# EAGLE design V3.81 - placa embutida rele smd (EAGLE 9.6.2)
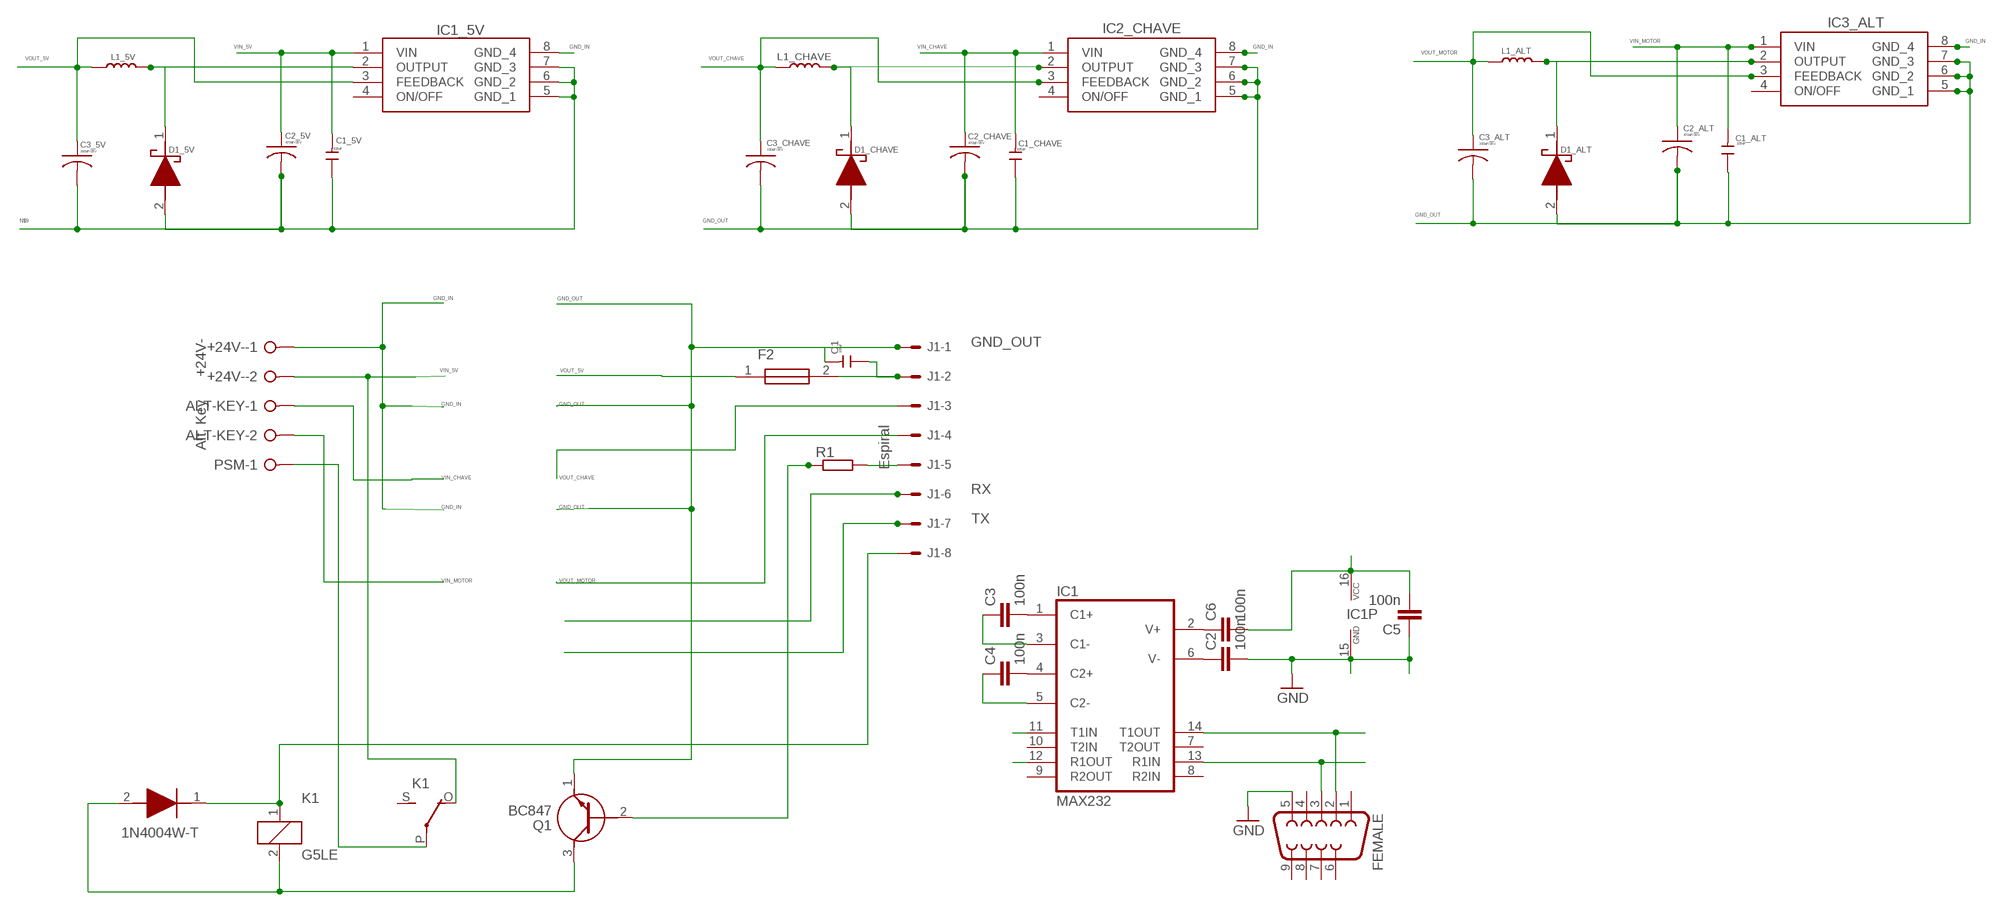
[diagram p0: schematic, sheet 1]

## Parts
+24V-  +24V-  W237-02P  [W237-132]
ALT-KEY  Alt Key  W237-02P  [W237-132]
C1  105uF  C-0805  [C0805]
C1_5V  105uF  C-0805  [C0805]
C1_ALT  105uF  C-0805  [C0805]
C1_CHAVE  105uF  C-0805  [C0805]
C2  100n  C-EUC0805  [C0805]
C2_5V  470uF/35V  C-USC0201  [C0201]
C2_ALT  470uF/35V  C-USC0201  [C0201]
C2_CHAVE  470uF/35V  C-USC0201  [C0201]
C3  100n  C-EUC0805  [C0805]
C3_5V  180uF/35V  C-USC0201  [C0201]
C3_ALT  330uF/35V  C-USC0201  [C0201]
C3_CHAVE  330uF/35V  C-USC0201  [C0201]
C4  100n  C-EUC0805  [C0805]
C5  100n  C-EUC0805  [C0805]
C6  100n  C-EUC0805  [C0805]
D1_5V  1N5819HW1-7-F  [SODFL3518X115N]
D1_ALT  1N5819HW1-7-F  [SODFL3518X115N]
D1_CHAVE  1N5819HW1-7-F  [SODFL3518X115N]
D2  1N4004W-T  [SODFL3818X130N]
F2  0679H1000-05  [FUSC6125X279N]
FEMALE  F09H  [F09H]
IC1  MAX232  MAX232ECWES  [SO16]
IC1_5V  XL1509-5.0E1  [SOIC127P600X175-8N]
IC2_CHAVE  XL1509-3.3E1  [SOIC127P600X175-8N]
IC3_ALT  XL1509-3.3E1  [SOIC127P600X175-8N]
J1  Espiral  22-05-7088-08  [7395-08]
K1  G5LE  [G5LE]
L1_5V  68uH  L'PIO73'  [PIO73]
L1_ALT  47uH  L'PIO73'  [PIO73]
L1_CHAVE  47uH  L'PIO73'  [PIO73]
PSM  PSM  W237-02P  [W237-132]
Q1  BC847  [BC847]
R1  SMR-WAV  [SMS-WAV]

## Nets
5V: C5.2 C6.2 IC1.16(VCC)
GND: C2.2 C5.1 FEMALE.5 IC1.15(GND)
GND_IN: +24V-.1 IC1_5V.8(GND_4) IC2_CHAVE.8(GND_4) IC3_ALT.8(GND_4)
GND_OUT: C1.2 C1_ALT.1 C1_CHAVE.1 C2_ALT.2 C2_CHAVE.2 C3_ALT.2 C3_CHAVE.2 D1_ALT.2(A) D1_CHAVE.2(A) IC2_CHAVE.5(GND_1) IC2_CHAVE.6(GND_2) IC2_CHAVE.7(GND_3) IC3_ALT.5(GND_1) IC3_ALT.6(GND_2) IC3_ALT.7(GND_3) J1.1 Q1.1(E)
N$1: D1_CHAVE.1(K) IC2_CHAVE.2(OUTPUT) L1_CHAVE.1
N$2: D1_5V.1(K) IC1_5V.2(OUTPUT) L1_5V.1
N$3: D1_ALT.1(K) IC3_ALT.2(OUTPUT) L1_ALT.1
N$5: Q1.2(B) R1.2
N$6: J1.5 R1.1
N$9: C1_5V.1 C2_5V.2 C3_5V.2 D1_5V.2(A) IC1_5V.5(GND_1) IC1_5V.6(GND_2) IC1_5V.7(GND_3)
N$10: C3.2 IC1.1(C1+)
N$11: C1.1 F2.2 J1.2
N$12: C4.2 IC1.4(C2+)
N$13: C3.1 IC1.3(C1-)
N$14: C4.1 IC1.5(C2-)
N$15: C6.1 IC1.2(V+)
N$16: C2.1 IC1.6(V-)
N$19: FEMALE.2 IC1.14(T1OUT)
N$20: FEMALE.3 IC1.13(R1IN)
N$38: D2.2(A) K1.2 Q1.3(C)
N$39: D2.1(K) J1.8 K1.1
N$40: K1.P(2:P) PSM.1
RX: IC1.12(R1OUT) J1.6
TX: IC1.11(T1IN) J1.7
VIN_5V: +24V-.2 C1_5V.2 C2_5V.1 IC1_5V.1(VIN) K1.O(2:O)
VIN_CHAVE: ALT-KEY.1 C1_CHAVE.2 C2_CHAVE.1 IC2_CHAVE.1(VIN)
VIN_MOTOR: ALT-KEY.2 C1_ALT.2 C2_ALT.1 IC3_ALT.1(VIN)
VOUT_5V: C3_5V.1 F2.1 IC1_5V.3(FEEDBACK) L1_5V.2
VOUT_CHAVE: C3_CHAVE.1 IC2_CHAVE.3(FEEDBACK) J1.3 L1_CHAVE.2
VOUT_MOTOR: C3_ALT.1 IC3_ALT.3(FEEDBACK) J1.4 L1_ALT.2
Unconnected: FEMALE.1 FEMALE.4 FEMALE.6 FEMALE.7 FEMALE.8 FEMALE.9 IC1.7(T2OUT) IC1.8(R2IN) IC1.9(R2OUT) IC1.10(T2IN) IC1_5V.4(ON/OFF) IC2_CHAVE.4(ON/OFF) IC3_ALT.4(ON/OFF) K1.S(2:S) PSM.2

## Library data of the parts
+24V- ALT-KEY PSM = con-wago-508:W237-02P: WAGO SREW CLAMP; OC_FARNELL: unknown; OC_NEWARK: unknown
C1 C1_5V C1_ALT C1_CHAVE = Discrete:C*: Ceramic Capacitors
C2-C6 = rcl:C-EU: CAPACITOR, European symbol
C2_5V C2_ALT C2_CHAVE C3_5V C3_ALT C3_CHAVE = rcl:C-US: CAPACITOR, American symbol; SPICEPREFIX: C
D1_5V D1_ALT D1_CHAVE = 1N5819HW1-7-F:1N5819HW1-7-F: 1N5819 Schottky Diode 40V 1A SOD123F Source: Datasheet <https://www.diodes.com/assets/Datasheets/1N5819HW1.pdf>; ARROW_PART_NUMBER: 1N5819HW1-7-F; ARROW_PRICE-STOCK: https://www.arrow.com/en/products/1n5819hw1-7-f/diodes-incorporated?region=nac; DESCRIPTION: 1N5819 Schottky Diode 40V 1A SOD123F; HEIGHT: 1.15mm; MANUFACTURER_NAME: Diodes Inc.; MANUFACTURER_PART_NUMBER: 1N5819HW1-7-F; MOUSER_PART_NUMBER: 621-1N5819HW1-7-F; MOUSER_PRICE-STOCK: https://www.mouser.co.uk/ProductDetail/Diodes-Incorporated/1N5819HW1-7-F?qs=60RJRzIpcl9ACQG7Zn63jQ%3D%3D
D2 = 1N4004W-T:1N4004W-T: Rectifiers SOD-123,1A,400V,GP Source: Datasheet <https://www.mouser.mx/datasheet/2/345/1n4001w_1n4007w-2449105.pdf>; DESCRIPTION: Rectifiers SOD-123,1A,400V,GP; HEIGHT: 1.3mm; MANUFACTURER_NAME: Rectron; MANUFACTURER_PART_NUMBER: 1N4004W-T; MOUSER_PART_NUMBER: 583-1N4004W-T; MOUSER_PRICE-STOCK: https://www.mouser.co.uk/ProductDetail/Rectron/1N4004W-T?qs=QNEnbhJQKvYW6o2Wv4Vvaw%3D%3D
F2 = 0679H1000-05:0679H1000-05: Fuse Chip Fast Acting 1A 350V Solder Pad SMD 2410 Ceramic T/R Source: Datasheet <https://www.arrow.com/en/products/0679h1000-05/bel-group>; ARROW_PART_NUMBER: 0679H1000-05; ARROW_PRICE-STOCK: https://www.arrow.com/en/products/0679h1000-05/bel-group?region=nac; DESCRIPTION: Fuse Chip Fast Acting 1A 350V Solder Pad SMD 2410 Ceramic T/R; HEIGHT: 2.79mm; MANUFACTURER_NAME: Bel Circuit Protection; MANUFACTURER_PART_NUMBER: 0679H1000-05
FEMALE = con-subd:F09: SUB-D
IC1 = maxim-6b:MAX232ECWE: RS232 TRANSEIVER
IC1_5V = XL1509-5.0E1:XL1509-5.0E1: 2A 150KHz 40V Buck DC to DC Converter. Source: Datasheet <https://datasheet.lcsc.com/szlcsc/XLSEMI-XL1509-5-0E1_C61063.pdf>; DESCRIPTION: 2A 150KHz 40V Buck DC to DC Converter.; HEIGHT: 1.75mm; MANUFACTURER_NAME: XLSEMI; MANUFACTURER_PART_NUMBER: XL1509-5.0E1
IC2_CHAVE IC3_ALT = XL1509-3.3E1:XL1509-3.3E1: 40V 2A SOP-8_150mil DC-DC Converters RoHS Source: Datasheet <https://datasheet.lcsc.com/szlcsc/XLSEMI-XL1509-3-3E1_C74193.pdf>; DESCRIPTION: 40V 2A SOP-8_150mil DC-DC Converters RoHS; HEIGHT: 1.75mm; MANUFACTURER_NAME: XLSEMI; MANUFACTURER_PART_NUMBER: XL1509-3.3E1
J1 = con-molex:22-?-08: CONNECTOR wire to board 2.54 mm (.1 inch) pitch header; MF: MOLEX; OC_FARNELL: unknown; OC_NEWARK: unknown
K1 = relay:G5LE: RELAY 1 x switch, 10 A/120 V AC, 8 A/30 V DC, Omron; OC_FARNELL: unknown; OC_NEWARK: unknown
L1_5V L1_ALT L1_CHAVE = Discrete:L*
Q1 = BC847:BC847: Epitaxial Planar NPN transistor Source: Datasheet <https://datasheet.datasheetarchive.com/originals/distributors/Datasheets-16/DSA-311605.pdf>; DESCRIPTION: Epitaxial Planar NPN transistor; HEIGHT: 1.3mm; MANUFACTURER_NAME: KEC; MANUFACTURER_PART_NUMBER: BC847
R1 = resistor-shunt:SMR-WAV: SMD SHUNT RESISTOR; OC_FARNELL: unknown; OC_NEWARK: unknown

## Module LDR
Ports: 

### Library data of the parts

## Net classes
1 New Class: width 0.5 mm, drill 1 mm

## Board
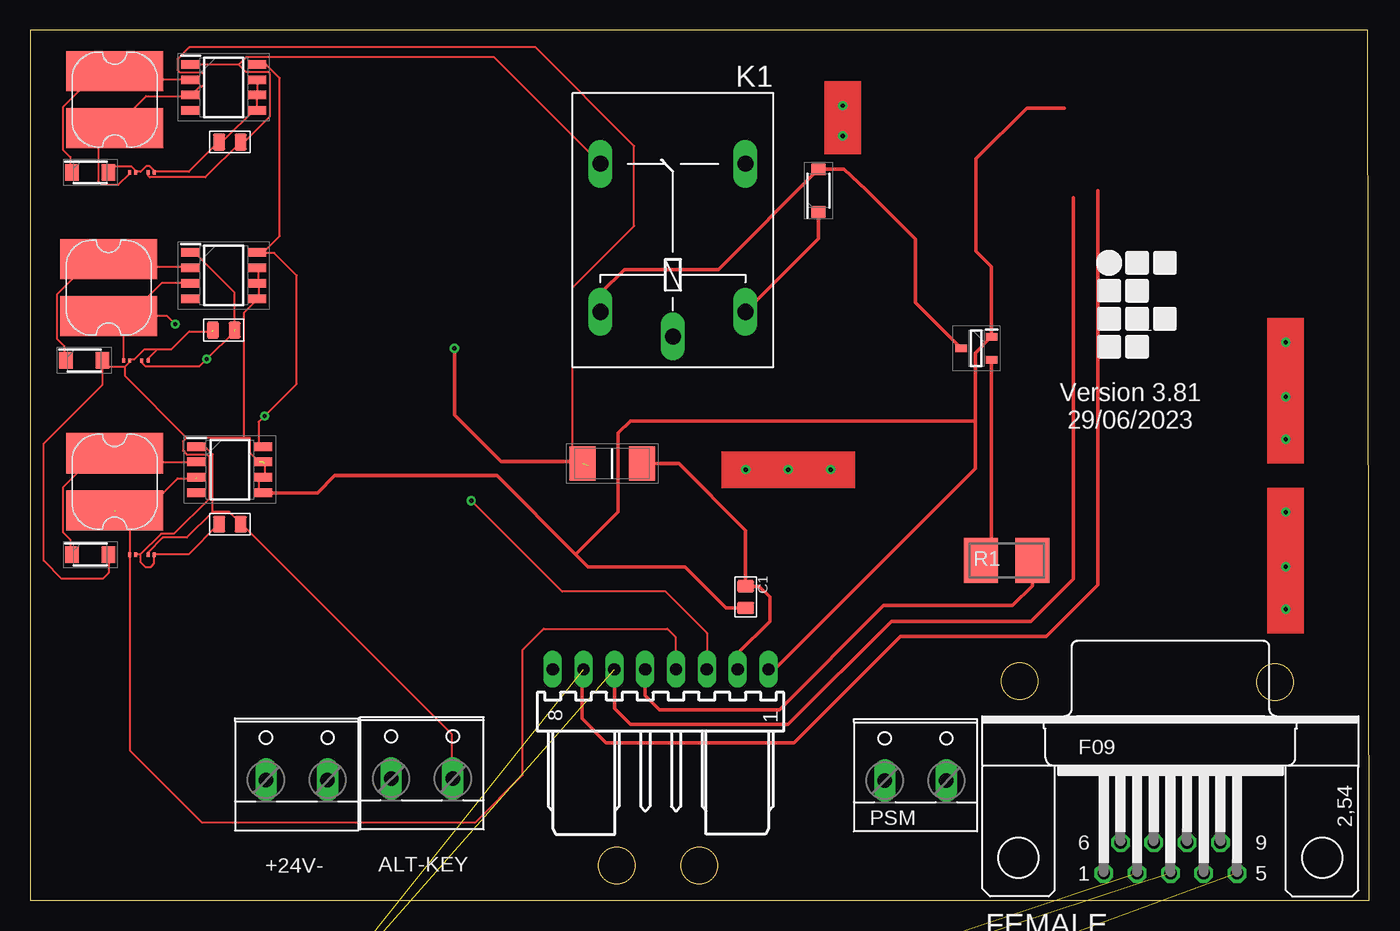
[diagram p1: board, top side]
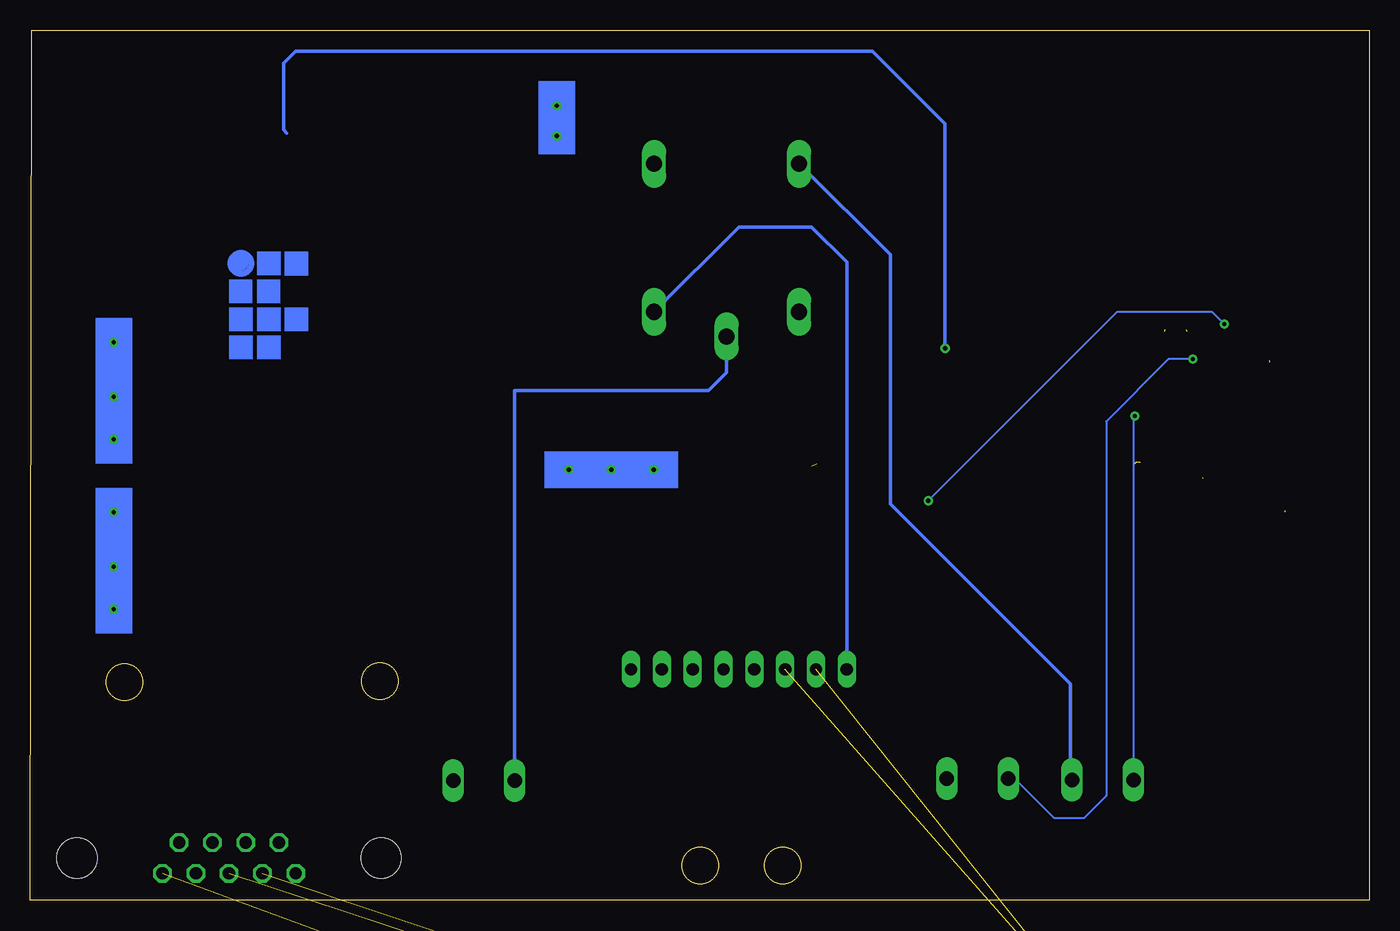
[diagram p2: board, bottom side, seen from below]

Size 110.32 x 71.7 mm. Coordinates in mm from the lower left corner, seen from the top.
Outline: 0,0 110.32,0 110.2,71.7 0,71.7 0,0
Outline: circle at 102.55,17.99 radius 1.5
Outline: circle at 81.51,18.05 radius 1.5
Outline: circle at 48.31,2.85 radius 1.5
Outline: circle at 55.11,2.85 radius 1.5
Copper layers (1*16): Top 0.035mm / dielectric 1.5mm / Bottom 0.035mm
Design rules "default *": minimum track width 6mil, minimum drill 0.35mm, track to track 6mil, track to pad 6mil, pad to pad 6mil, via to via 6mil, smd to smd 6mil, copper to edge 40mil, drill to drill 6mil, minimum pad ring 10mil, minimum via ring 8mil, stop-mask expansion 4mil, vias tented up to drill 0mil, thermal gap 10mil

### Footprints (pad centres in the part's own frame; a part is rotated, then mirrored left to right if it is on the bottom)
W237-132 = drill 1.194 long: 1 -2.54,-0.635; 2 2.54,-0.635
C0805 = smd 1.016 x 1.397: 1 -0.889,0; 2 0.889,0
C0805' = smd 1.3 x 1.5: 1 -0.95,0; 2 0.95,0
C0201 = smd 0.25 x 0.35: 1 -0.25,0; 2 0.25,0
SODFL3518X115N = smd 1.12 x 1.37: 1 -1.5,0; 2 1.5,0
SODFL3818X130N = smd 0.92 x 1.13: 1 -1.75,0; 2 1.75,0
FUSC6125X279N = smd 2.15 x 2.8: 1 -2.455,0; 2 2.455,0
F09H = drill 1.016 octagon: 1 -5.486,-1.27; 2 -2.743,-1.27; 3 0,-1.27; 4 2.743,-1.27; 5 5.486,-1.27; 6 -4.115,1.27; 7 -1.372,1.27; 8 1.372,1.27; 9 4.115,1.27 | hole 3.302: -12.522,0; 12.522,0
SO16 = smd 0.66 x 2.032: 1 -4.445,-3.073; 2 -3.175,-3.073; 3 -1.905,-3.073; 4 -0.635,-3.073; 5 0.635,-3.073; 6 1.905,-3.073; 7 3.175,-3.073; 8 4.445,-3.073; 9 4.445,3.073; 10 3.175,3.073; 11 1.905,3.073; 12 0.635,3.073; 13 -0.635,3.073; 14 -1.905,3.073; 15 -3.175,3.073; 16 -4.445,3.073
SOIC127P600X175-8N = smd 1.55 x 0.7: 1 -2.725,1.905; 2 -2.725,0.635; 3 -2.725,-0.635; 4 -2.725,-1.905; 5 2.725,-1.905; 6 2.725,-0.635; 7 2.725,0.635; 8 2.725,1.905
7395-08 = drill 1.016 long: 1 8.89,0; 2 6.35,0; 3 3.81,0; 4 1.27,0; 5 -1.27,0; 6 -3.81,0; 7 -6.35,0; 8 -8.89,0
G5LE = drill 1.321 long: 1 -7.493,-5.969; 2 -7.493,5.969; O 4.699,5.969; P -9.525,0; S 4.699,-5.969
PIO73 = smd 8 x 3.3: 1 0,2.35; 2 0,-2.35
BC847 = smd 0.95 x 0.65: 1 -1.25,-0.95; 2 -1.25,0.95; 3 1.25,0
SMS-WAV = smd 2.8 x 3.7: 1 2.108,0; 2 -2.108,0

### Placement (x,y rotation side)
+24V-  21.95,10.56 0 top
ALT-KEY  32.27,10.66 0 top
C1  58.94,24.99 270 top
C1_5V  16.44,62.49 0 top
C1_ALT  16.44,30.99 0 top
C1_CHAVE  15.94,46.99 0 top
C2  100n  [C0805']  14.94,-28.51 0 top  (outside the outline)
C2_5V  9.94,59.99 0 top
C2_ALT  9.94,28.49 0 top
C2_CHAVE  9.44,44.49 0 top
C3  100n  [C0805']  20.44,-28.51 0 top  (outside the outline)
C3_5V  8.44,59.99 0 top
C3_ALT  8.44,28.49 0 top
C3_CHAVE  7.94,44.49 0 top
C4  100n  [C0805']  25.94,-28.51 0 top  (outside the outline)
C5  100n  [C0805']  2.44,-37.01 0 top  (outside the outline)
C6  100n  [C0805']  7.94,-37.01 0 top  (outside the outline)
D1_5V  4.94,59.99 0 top
D1_ALT  4.94,28.49 0 top
D1_CHAVE  4.44,44.49 0 top
D2  64.94,58.49 90 top
F2  47.94,35.99 0 top
FEMALE  93.94,3.49 0 top
IC1  7.44,-29.51 0 top  (outside the outline)
IC1_5V  15.94,66.99 0 top
IC2_CHAVE  15.94,51.49 0 top
IC3_ALT  16.44,35.49 0 top
J1  51.93,19.03 0 top
K1  52.94,55.99 90 top
L1_5V  6.94,65.99 0 top
L1_ALT  6.94,34.49 0 top
L1_CHAVE  6.44,50.49 0 top
PSM  72.94,10.49 0 top
Q1  77.94,45.49 180 top
R1  80.44,27.99 0 top

### Tracks (layer width: path | path; a pad name or v marks a point on that pad's centre or on a via)
5V  (2 unrouted)
GND  (3 unrouted)
GND_IN  (via drill 0.35)
  Top 0.152: IC3_ALT.8 18.8,37.77 18.8,39.42 v19.3,39.92 21.94,42.57 21.94,51.49 20.1,53.34 18.91,53.34 | 19.1,53.29 18.8,53.29 IC2_CHAVE.8 18.91,53.34 | 19.1,53.29 20.56,54.75 20.56,67.77 19.45,68.88 18.69,68.88 IC1_5V.8 | 19.1,53.29 18.91,53.34
  Bottom 0.152: v19.3,39.92 19.41,39.81 +24V-.1
GND_OUT  (4 unrouted)
  Top 0.152: 10.44,45.41 11.61,45.41 13.09,46.89 14.99,46.89 | 10.44,45.41 9.39,45.41 8.59,44.6 8.3,44.6 C3_CHAVE.2 | 7.83,44 6.45,44 6,44.45 D1_CHAVE.2 5.94,42.49 1.09,37.64 1.09,27.99 2.59,26.49 5.94,26.49 6.44,26.99 D1_ALT.2 | C1_ALT.1 15.49,30.96 13.05,28.52 10.31,28.52 C2_ALT.2 10.19,27.74 9.94,27.49 9.44,27.49 9.06,27.87 9.06,28.49 | IC3_ALT.5 18.8,33.96 18.8,34.49 IC3_ALT.6 19.17,35.09 19.3,35.14 19.3,36 | IC2_CHAVE.7 18.8,52.07 18.8,51.01 IC2_CHAVE.6 18.8,50.85 18.8,49.63 IC2_CHAVE.5 18.65,49.48 17.58,48.41 17.58,38.12 | 18.84,36.14 18.08,36.9 18.08,38.12 17.58,38.12 | 12.9,38.12 12.59,37.81 12.59,37.05 12.9,36.75 14.57,36.75 14.73,36.59 14.73,33.09 11.83,30.19 10.76,30.19 9.06,28.49 | 17.58,38.12 12.9,38.12 | 7.83,44 7.83,43.19 12.9,38.12 | 9.06,28.49 C3_ALT.2 | 7.83,44 8.19,44.36 | C2_CHAVE.2 9.69,44.66 10.44,45.41
  Top 0.305: 85.2,65.29 82.12,65.29 77.93,61.11 77.93,53.49 79.19,52.24 Q1.1 77.86,45.11 77.86,39.49 | IC3_ALT.5 23.67,33.59 25.07,34.99 38.44,34.99 44.94,28.49 | J1.1 61.32,19.03 76.61,34.33 76.68,34.4 77.86,35.58 77.86,36.22 77.86,36.49 77.86,39.49 | 44.94,28.49 45.94,27.49 53.94,27.49 57.33,24.11 C1.2 | 77.86,39.49 49.44,39.49 48.44,38.49 48.44,31.99 44.94,28.49
N$1
  Top 0.152: D1_CHAVE.1 2.8,44.6 2.8,45.67 2.19,46.28 2.19,49.94 5.08,52.83 6.3,52.83 L1_CHAVE.1 7.06,52.22 13.16,52.22 IC2_CHAVE.2
N$2
  Top 0.152: D1_5V.1 3.3,60.04 3.3,61.26 2.69,61.87 2.69,65.37 5.58,68.27 6.8,68.27 L1_5V.1 6.95,68.27 7.56,67.66 13.2,67.66 IC1_5V.2
N$3
  Top 0.152: D1_ALT.1 3.3,28.52 3.3,29.74 2.69,30.35 2.69,34 5.43,36.75 6.8,36.75 L1_ALT.1 6.95,36.75 7.56,36.14 13.71,36.14 IC3_ALT.2
N$5
  Top 0.152: 78.43,28.07 R1.2
  Top 0.305: R1.2 79.19,28.85 Q1.2
N$6
  Top 0.305: J1.5 50.66,16.88 51.83,15.72 61.73,15.72 70.3,24.29 80.91,24.29 82.55,25.93 R1.1
N$9
  Top 0.152: 10.31,60.04 9.85,60.5 9.54,60.5 9.09,60.04 8.78,60.04 C3_5V.2 8.63,60.04 8.63,60.19 8.33,60.5 6.95,60.5 6.5,60.04 D1_5V.2 | IC1_5V.7 18.69,67.51 18.69,66.44 IC1_5V.6 18.69,66.29 18.69,65.22 IC1_5V.5 18.54,65.22 15.95,62.63 15.64,62.63 C1_5V.1 15.49,62.48 13.05,60.04 10.31,60.04 | 10.31,60.04 C2_5V.2
N$10  (1 unrouted)
N$11
  Top 0.305: F2.2 53.44,35.99 58.94,30.49 C1.1 60.05,25.88 60.94,24.99 60.94,22.99 58.28,20.33 J1.2
N$12  (1 unrouted)
N$13  (1 unrouted)
N$14  (1 unrouted)
N$15  (1 unrouted)
N$16  (1 unrouted)
N$19  (1 unrouted)
N$20  (1 unrouted)
N$24  (via drill 0.35)
  other vias: 103.44,45.99
N$25  (via drill 0.35)
  other vias: 103.44,37.99
N$26  (via drill 0.35)
  other vias: 103.44,41.49
N$27  (via drill 0.35)
  other vias: 103.44,31.99
N$28  (via drill 0.35)
  other vias: 103.44,23.99
N$29  (via drill 0.35)
  other vias: 103.44,27.49
N$30  (via drill 0.35)
  other vias: 66.94,65.49
N$31  (via drill 0.35)
  other vias: 66.94,62.99
N$32  (via drill 0.35)
  other vias: 58.94,35.49
N$33  (via drill 0.35)
  other vias: 65.94,35.49
N$34  (via drill 0.35)
  other vias: 62.44,35.49
N$38
  Top 0.305: Q1.3 72.94,49.24 72.94,54.49 68.86,58.57 67.03,60.24 D2.2 56.69,51.99 48.94,51.99 46.97,50.03 K1.2
N$39
  Top 0.305: K1.1 64.94,54.53 D2.1
  Bottom 0.305: K1.1 51.92,55.49 45.94,55.49 43.04,52.59 J1.8
N$40
  Bottom 0.305: PSM.1 70.4,41.99 54.44,41.99 52.94,43.49 K1.P
RX  (1 unrouted)
  Top 0.305: J1.6 48.12,15.82 49.44,14.49 62.44,14.49 70.94,22.99 82.44,22.99 85.94,26.49 85.94,57.92
TX  (1 unrouted)
  Top 0.305: 87.94,58.48 87.94,25.99 83.71,21.76 71.71,21.76 62.94,12.99 47.44,12.99 45.44,14.99 45.44,18.9 J1.7
VIN_5V
  Top 0.152: C2_5V.1 9.7,59.89 9.7,59.74 9.85,59.58 14.42,59.58 17.32,62.48 C1_5V.2 17.47,62.63 17.77,62.63 19.76,64.61 19.76,68.12 19.6,68.27 17.77,68.27 17.16,68.88 | 17.16,68.88 13.35,68.88 IC1_5V.1 | 17.16,68.88 17.77,69.49 38.2,69.49 46.88,60.8 K1.O
  Bottom 0.152: 24.63,10.05 +24V-.2 | 46.88,60.65 K1.O
  Bottom 0.305: 24.63,10.05 24.63,17.83 39.46,32.66 39.46,53.23 46.88,60.65
VIN_CHAVE  (via drill 0.35)  (2 unrouted)
  Top 0.152: 16.82,46.89 v14.53,44.6 13.92,44 9.5,44 9.19,44.3 C2_CHAVE.1 | 16.82,47.04 16.82,50.09 13.62,53.29 13.31,53.29 IC2_CHAVE.1
  Bottom 0.152: v14.53,44.6 16.53,44.6 21.67,39.47 21.67,8.62 23.52,6.77 25.94,6.77 29.07,9.9 29.66,9.9 ALT-KEY.1
VIN_MOTOR
  Top 0.152: 15.03,32.02 12.9,29.89 10.92,29.89 9.7,28.67 9.7,28.52 C2_ALT.1 | 15.03,32.02 16.4,32.02 17.32,31.11 C1_ALT.2 17.47,30.96 34.69,13.73 34.69,10.05 ALT-KEY.2 | 15.03,32.02 15.03,36.75 14.42,37.36 14.31,37.36 14.22,37.4 IC3_ALT.1
VOUT_5V  (via drill 0.35)  (1 unrouted)
  Top 0.152: C3_5V.1 8.17,59.89 7.26,58.97 5.89,58.97 5.58,59.28 5.58,62.33 6.8,63.55 L1_5V.2 6.95,63.7 9.54,66.29 13.2,66.29 IC1_5V.3 13.35,66.44 13.96,67.05 14.12,67.05 14.27,67.2 14.27,68.12 14.12,68.27 12.29,68.27 12.14,68.42 12.14,69.34 13.09,70.29 41.63,70.29 49.75,62.17 49.75,55.57 44.66,50.48 44.66,37.11 45.61,36.16 45.97,35.81
  Top 0.305: v34.94,45.49 34.94,39.99 38.77,36.16 45.61,36.16
  Bottom 0.305: 89.18,63.23 89.44,63.49 89.44,68.99 88.44,69.99 40.94,69.99 34.94,63.99 v34.94,45.49
VOUT_CHAVE  (via drill 0.35)
  Top 0.152: J1.3 55.74,22.03 52.34,25.44 43.83,25.44 v36.33,32.94 | C3_CHAVE.1 7.69,46.87 | 7.69,46.87 7.42,47.14 | 7.27,47.32 L1_CHAVE.2 11.29,48.14 v11.94,47.49 | 7.27,47.32 7.69,46.89 7.69,46.87 | IC2_CHAVE.3 10.81,50.86 7.27,47.32
  Bottom 0.152: v11.94,47.49 12.94,48.49 20.77,48.49 v36.33,32.94
VOUT_MOTOR  (2 unrouted)
  Top 0.152: 7.67,31.3 7.67,31.25 8.19,30.67 C3_ALT.1 8.19,12.34 14.12,6.42 36.67,6.42 40.58,10.33 40.58,20.65 42.3,22.37 52.5,22.37 53.2,21.67 J1.4 | 6.95,32.02 7.67,31.3 | 7.67,31.3 8.17,30.8 12.14,34.77 13.66,34.77
  Top 0.61: J1.4 53.17,19
(copper drawn outside any net)
  shapes: Bottom area x13, Bottom circle x3, Top area x4

### Text on the board
tNames: Version 3.81 / 29/06/2023